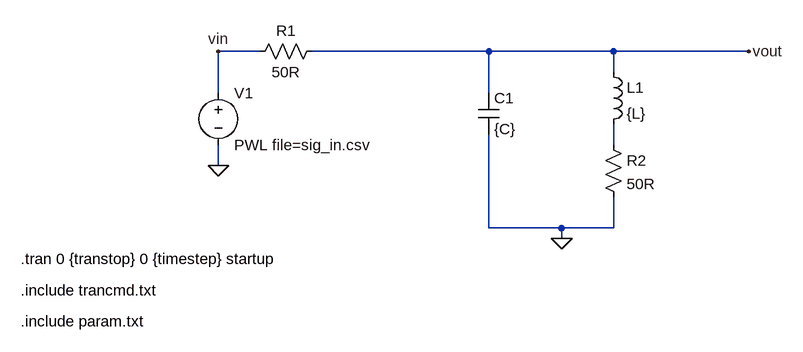
[diagram p0: schematic filter_circuit.asc]
filter_circuit.asc, the LTspice schematic file:
Version 4
SHEET 1 980 680
WIRE 160 32 96 32
WIRE 512 32 240 32
WIRE 704 32 512 32
WIRE 912 32 704 32
WIRE 704 64 704 32
WIRE 96 96 96 32
WIRE 512 96 512 32
WIRE 704 176 704 144
WIRE 96 208 96 176
WIRE 512 304 512 160
WIRE 624 304 512 304
WIRE 704 304 704 256
WIRE 704 304 624 304
WIRE 624 320 624 304
FLAG 96 208 0
FLAG 624 320 0
FLAG 912 32 vout
FLAG 96 32 vin
SYMBOL voltage 96 80 R0
WINDOW 123 0 0 Left 0
WINDOW 39 0 0 Left 0
SYMATTR InstName V1
SYMATTR Value PWL file=sig_in.csv
SYMBOL res 256 16 R90
WINDOW 0 0 56 VBottom 2
WINDOW 3 32 56 VTop 2
SYMATTR InstName R1
SYMATTR Value 50R
SYMBOL cap 496 96 R0
SYMATTR InstName C1
SYMATTR Value {C}
SYMBOL ind 688 48 R0
SYMATTR InstName L1
SYMATTR Value {L}
SYMBOL res 688 160 R0
SYMATTR InstName R2
SYMATTR Value 50R
TEXT -208 352 Left 2 !.tran 0 {transtop} 0 {timestep} startup
TEXT -208 400 Left 2 !.include trancmd.txt
TEXT -208 448 Left 2 !.include param.txt

The netlist it stands for:
* filter_circuit.asc
V1 vin 0 PWL file=sig_in.csv
R1 vout vin 50R
C1 vout 0 {C}
L1 vout N001 {L}
R2 N001 0 50R
.tran 0 {transtop} 0 {timestep} startup
.include trancmd.txt
.include param.txt
.backanno
.end